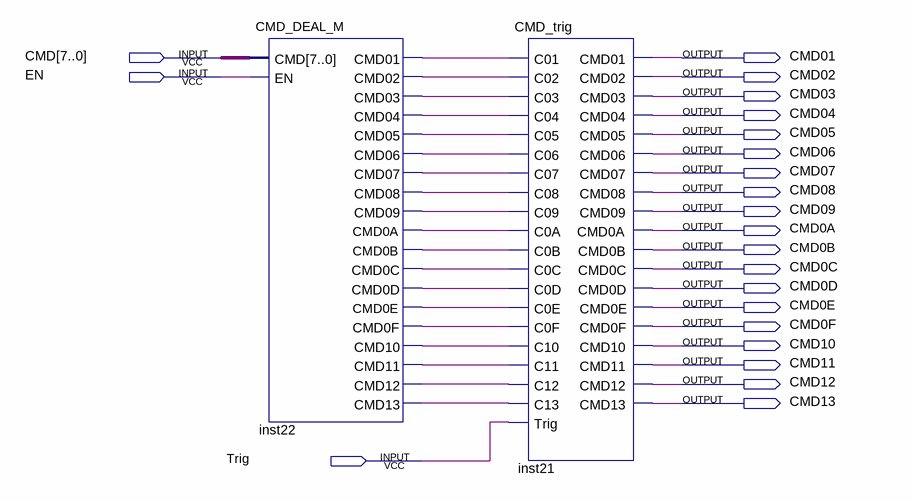
[diagram p0: schematic sheet]
// Quartus schematic CMD_AUX_DEAL.bdf as structural Verilog: 2 symbols, 22 pins
module CMD_AUX_DEAL (
  input  [7:0] CMD,
  input  EN,
  input  Trig,
  output CMD01,
  output CMD02,
  output CMD03,
  output CMD04,
  output CMD05,
  output CMD06,
  output CMD07,
  output CMD08,
  output CMD09,
  output CMD0A,
  output CMD0B,
  output CMD0C,
  output CMD0D,
  output CMD0E,
  output CMD0F,
  output CMD10,
  output CMD11,
  output CMD12,
  output CMD13
);

  wire inst22_cmd0a, inst22_cmd0b, inst22_cmd0c, inst22_cmd0d, inst22_cmd0e, inst22_cmd0f, inst22_cmd01,
       inst22_cmd02, inst22_cmd03, inst22_cmd04, inst22_cmd05, inst22_cmd06, inst22_cmd07, inst22_cmd08,
       inst22_cmd09, inst22_cmd10, inst22_cmd11, inst22_cmd12, inst22_cmd13;

  CMD_DEAL_M inst22 (
    .CMD(CMD), .EN(EN), .CMD01(inst22_cmd01), .CMD02(inst22_cmd02), .CMD03(inst22_cmd03),
    .CMD04(inst22_cmd04), .CMD05(inst22_cmd05), .CMD06(inst22_cmd06), .CMD07(inst22_cmd07),
    .CMD08(inst22_cmd08), .CMD09(inst22_cmd09), .CMD0A(inst22_cmd0a), .CMD0B(inst22_cmd0b),
    .CMD0C(inst22_cmd0c), .CMD0D(inst22_cmd0d), .CMD0E(inst22_cmd0e), .CMD0F(inst22_cmd0f),
    .CMD10(inst22_cmd10), .CMD11(inst22_cmd11), .CMD12(inst22_cmd12), .CMD13(inst22_cmd13));
  CMD_trig inst21 (
    .C01(inst22_cmd01), .C02(inst22_cmd02), .C03(inst22_cmd03), .C04(inst22_cmd04), .C05(inst22_cmd05),
    .C06(inst22_cmd06), .C07(inst22_cmd07), .C08(inst22_cmd08), .C09(inst22_cmd09), .C0A(inst22_cmd0a),
    .C0B(inst22_cmd0b), .C0C(inst22_cmd0c), .C0D(inst22_cmd0d), .C0E(inst22_cmd0e), .C0F(inst22_cmd0f),
    .C10(inst22_cmd10), .C11(inst22_cmd11), .C12(inst22_cmd12), .C13(inst22_cmd13), .Trig(Trig),
    .CMD01(CMD01), .CMD02(CMD02), .CMD03(CMD03), .CMD04(CMD04), .CMD05(CMD05), .CMD06(CMD06), .CMD07(CMD07),
    .CMD08(CMD08), .CMD09(CMD09), .CMD0A(CMD0A), .CMD0B(CMD0B), .CMD0C(CMD0C), .CMD0D(CMD0D), .CMD0E(CMD0E),
    .CMD0F(CMD0F), .CMD10(CMD10), .CMD11(CMD11), .CMD12(CMD12), .CMD13(CMD13));
endmodule
